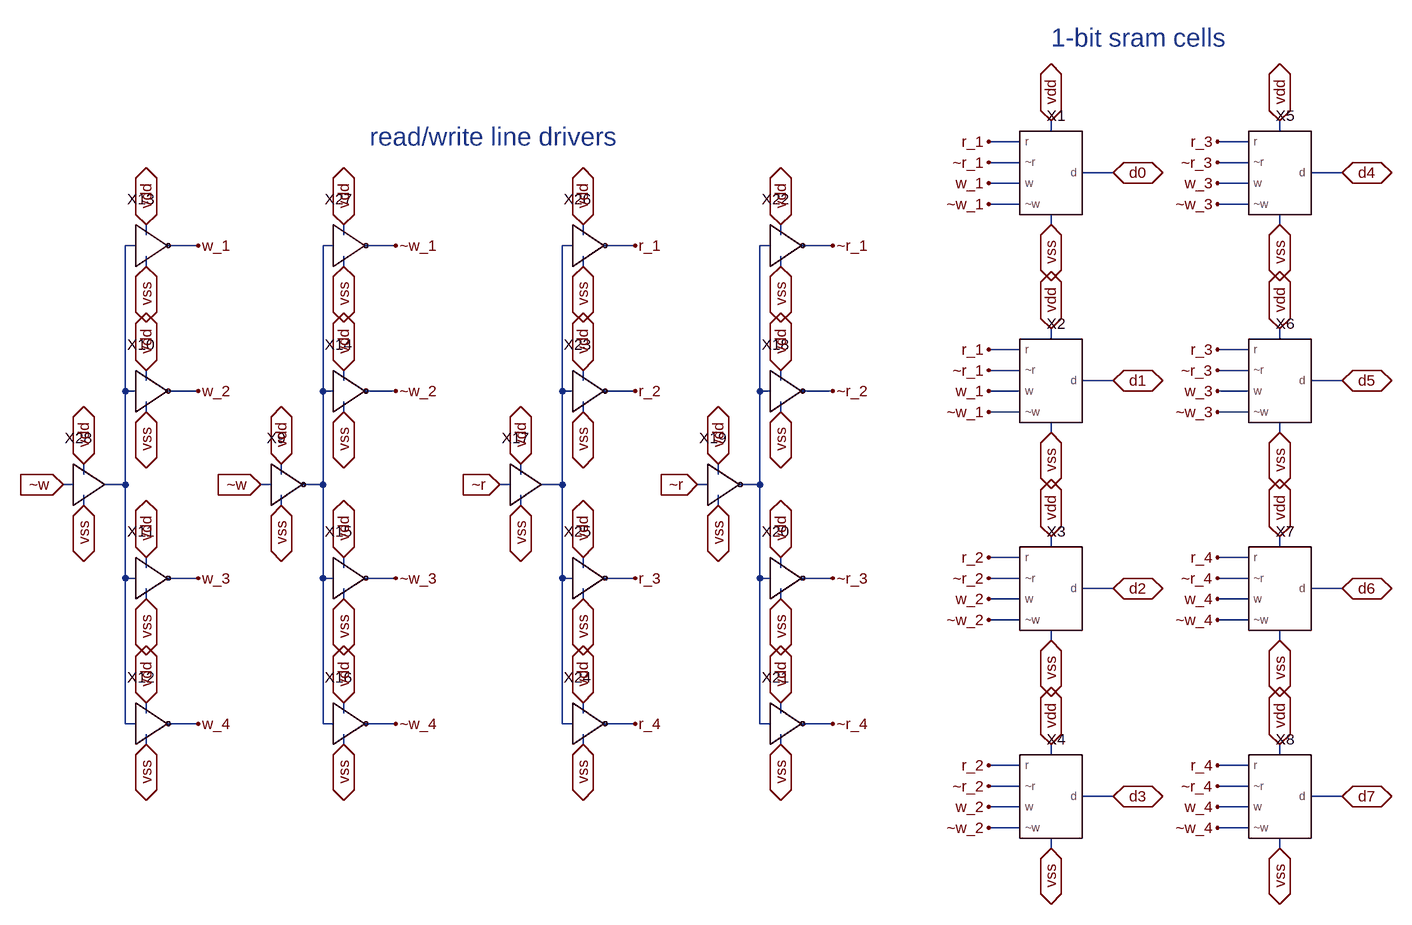
[diagram p0: schematic 8_bit_sram_cell.asc]
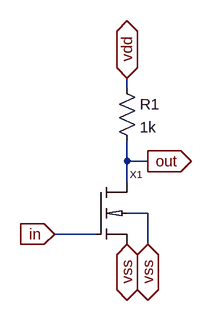
[diagram p1: sub-circuit not.asc]
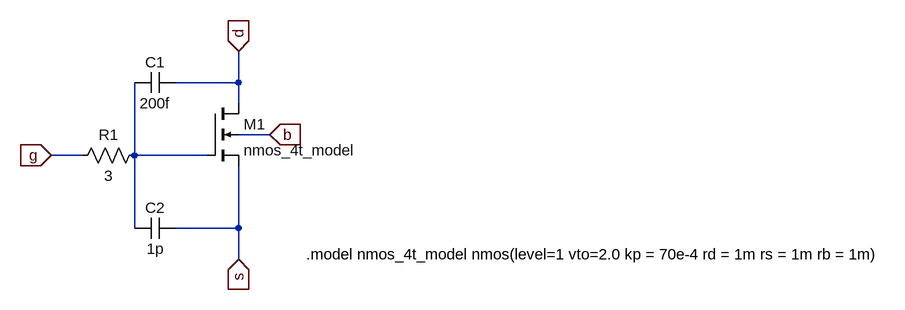
[diagram p2: sub-circuit nmos_4t.asc]
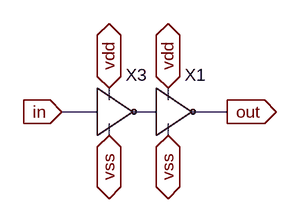
[diagram p3: sub-circuit buffer.asc]
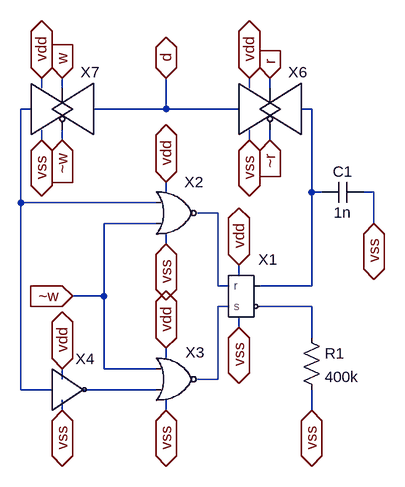
[diagram p4: sub-circuit 1_bit_sram_cell.asc]
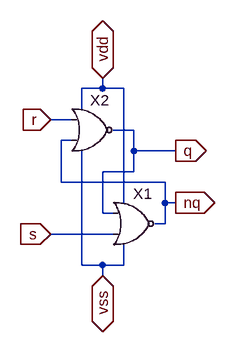
[diagram p5: sub-circuit sr_latch.asc]
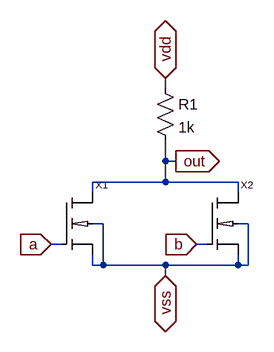
[diagram p6: sub-circuit nor.asc]
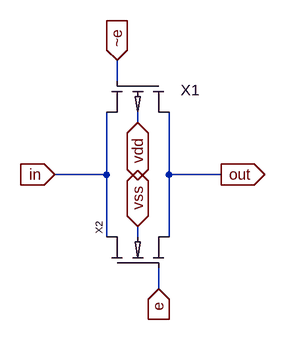
[diagram p7: sub-circuit transmission_gate.asc]
8_bit_sram_cell.asc, the LTspice schematic file:
Version 4
SHEET 1 880 1872
WIRE 208 -1088 208 -1104
WIRE 560 -1088 560 -1104
WIRE 160 -1072 112 -1072
WIRE 512 -1072 464 -1072
WIRE 160 -1040 112 -1040
WIRE 512 -1040 464 -1040
WIRE 304 -1024 256 -1024
WIRE 656 -1024 608 -1024
WIRE 160 -1008 112 -1008
WIRE 512 -1008 464 -1008
WIRE 160 -976 112 -976
WIRE 512 -976 464 -976
WIRE 208 -944 208 -960
WIRE 560 -944 560 -960
WIRE -1184 -928 -1184 -944
WIRE -880 -928 -880 -944
WIRE -512 -928 -512 -944
WIRE -208 -928 -208 -944
WIRE -1200 -912 -1216 -912
WIRE -1104 -912 -1152 -912
WIRE -896 -912 -912 -912
WIRE -800 -912 -848 -912
WIRE -528 -912 -544 -912
WIRE -432 -912 -480 -912
WIRE -224 -912 -240 -912
WIRE -128 -912 -176 -912
WIRE -1184 -880 -1184 -896
WIRE -880 -880 -880 -896
WIRE -512 -880 -512 -896
WIRE -208 -880 -208 -896
WIRE 208 -768 208 -784
WIRE 560 -768 560 -784
WIRE 160 -752 112 -752
WIRE 512 -752 464 -752
WIRE 160 -720 112 -720
WIRE 512 -720 464 -720
WIRE -1184 -704 -1184 -720
WIRE -880 -704 -880 -720
WIRE -512 -704 -512 -720
WIRE -208 -704 -208 -720
WIRE 304 -704 256 -704
WIRE 656 -704 608 -704
WIRE -1216 -688 -1216 -912
WIRE -1200 -688 -1216 -688
WIRE -1104 -688 -1152 -688
WIRE -912 -688 -912 -912
WIRE -896 -688 -912 -688
WIRE -800 -688 -848 -688
WIRE -544 -688 -544 -912
WIRE -528 -688 -544 -688
WIRE -432 -688 -480 -688
WIRE -240 -688 -240 -912
WIRE -224 -688 -240 -688
WIRE -128 -688 -176 -688
WIRE 160 -688 112 -688
WIRE 512 -688 464 -688
WIRE -1184 -656 -1184 -672
WIRE -880 -656 -880 -672
WIRE -512 -656 -512 -672
WIRE -208 -656 -208 -672
WIRE 160 -656 112 -656
WIRE 512 -656 464 -656
WIRE 208 -624 208 -640
WIRE 560 -624 560 -640
WIRE -1280 -560 -1280 -576
WIRE -976 -560 -976 -576
WIRE -608 -560 -608 -576
WIRE -304 -560 -304 -576
WIRE -1296 -544 -1312 -544
WIRE -1216 -544 -1216 -688
WIRE -1216 -544 -1248 -544
WIRE -992 -544 -1008 -544
WIRE -912 -544 -912 -688
WIRE -912 -544 -944 -544
WIRE -624 -544 -640 -544
WIRE -544 -544 -544 -688
WIRE -544 -544 -576 -544
WIRE -320 -544 -336 -544
WIRE -240 -544 -240 -688
WIRE -240 -544 -272 -544
WIRE -1280 -512 -1280 -528
WIRE -976 -512 -976 -528
WIRE -608 -512 -608 -528
WIRE -304 -512 -304 -528
WIRE 208 -448 208 -464
WIRE 560 -448 560 -464
WIRE 160 -432 112 -432
WIRE 512 -432 464 -432
WIRE -1184 -416 -1184 -432
WIRE -880 -416 -880 -432
WIRE -512 -416 -512 -432
WIRE -208 -416 -208 -432
WIRE -1216 -400 -1216 -544
WIRE -1200 -400 -1216 -400
WIRE -1104 -400 -1152 -400
WIRE -912 -400 -912 -544
WIRE -896 -400 -912 -400
WIRE -800 -400 -848 -400
WIRE -544 -400 -544 -544
WIRE -528 -400 -544 -400
WIRE -432 -400 -480 -400
WIRE -240 -400 -240 -544
WIRE -224 -400 -240 -400
WIRE -128 -400 -176 -400
WIRE 160 -400 112 -400
WIRE 512 -400 464 -400
WIRE 304 -384 256 -384
WIRE 656 -384 608 -384
WIRE -1184 -368 -1184 -384
WIRE -880 -368 -880 -384
WIRE -512 -368 -512 -384
WIRE -208 -368 -208 -384
WIRE 160 -368 112 -368
WIRE 512 -368 464 -368
WIRE 160 -336 112 -336
WIRE 512 -336 464 -336
WIRE 208 -304 208 -320
WIRE 560 -304 560 -320
WIRE -1184 -192 -1184 -208
WIRE -880 -192 -880 -208
WIRE -512 -192 -512 -208
WIRE -208 -192 -208 -208
WIRE -1216 -176 -1216 -400
WIRE -1200 -176 -1216 -176
WIRE -1104 -176 -1152 -176
WIRE -912 -176 -912 -400
WIRE -896 -176 -912 -176
WIRE -800 -176 -848 -176
WIRE -544 -176 -544 -400
WIRE -528 -176 -544 -176
WIRE -432 -176 -480 -176
WIRE -240 -176 -240 -400
WIRE -224 -176 -240 -176
WIRE -128 -176 -176 -176
WIRE -1184 -144 -1184 -160
WIRE -880 -144 -880 -160
WIRE -512 -144 -512 -160
WIRE -208 -144 -208 -160
WIRE 208 -128 208 -144
WIRE 560 -128 560 -144
WIRE 160 -112 112 -112
WIRE 512 -112 464 -112
WIRE 160 -80 112 -80
WIRE 512 -80 464 -80
WIRE 304 -64 256 -64
WIRE 656 -64 608 -64
WIRE 160 -48 112 -48
WIRE 512 -48 464 -48
WIRE 160 -16 112 -16
WIRE 512 -16 464 -16
WIRE 208 16 208 0
WIRE 560 16 560 0
FLAG 208 -1104 vdd
IOPIN 208 -1104 BiDir
FLAG 208 -944 vss
IOPIN 208 -944 BiDir
FLAG 208 -784 vdd
IOPIN 208 -784 BiDir
FLAG 208 -624 vss
IOPIN 208 -624 BiDir
FLAG 208 -464 vdd
IOPIN 208 -464 BiDir
FLAG 208 -304 vss
IOPIN 208 -304 BiDir
FLAG 208 -144 vdd
IOPIN 208 -144 BiDir
FLAG 208 16 vss
IOPIN 208 16 BiDir
FLAG 560 -1104 vdd
IOPIN 560 -1104 BiDir
FLAG 560 -944 vss
IOPIN 560 -944 BiDir
FLAG 560 -784 vdd
IOPIN 560 -784 BiDir
FLAG 560 -624 vss
IOPIN 560 -624 BiDir
FLAG 560 -464 vdd
IOPIN 560 -464 BiDir
FLAG 560 -304 vss
IOPIN 560 -304 BiDir
FLAG 560 -144 vdd
IOPIN 560 -144 BiDir
FLAG 560 16 vss
IOPIN 560 16 BiDir
FLAG -608 -576 vdd
IOPIN -608 -576 BiDir
FLAG -608 -512 vss
IOPIN -608 -512 BiDir
FLAG -640 -544 ~r
IOPIN -640 -544 In
FLAG -512 -656 vss
IOPIN -512 -656 BiDir
FLAG -512 -720 vdd
IOPIN -512 -720 BiDir
FLAG -432 -912 r_1
FLAG -512 -368 vss
IOPIN -512 -368 BiDir
FLAG -512 -432 vdd
IOPIN -512 -432 BiDir
FLAG -432 -688 r_2
FLAG -512 -144 vss
IOPIN -512 -144 BiDir
FLAG -512 -208 vdd
IOPIN -512 -208 BiDir
FLAG -432 -400 r_3
FLAG -512 -880 vss
IOPIN -512 -880 BiDir
FLAG -512 -944 vdd
IOPIN -512 -944 BiDir
FLAG -432 -176 r_4
FLAG -304 -576 vdd
IOPIN -304 -576 BiDir
FLAG -304 -512 vss
IOPIN -304 -512 BiDir
FLAG -336 -544 ~r
IOPIN -336 -544 In
FLAG -208 -656 vss
IOPIN -208 -656 BiDir
FLAG -208 -720 vdd
IOPIN -208 -720 BiDir
FLAG -128 -912 ~r_1
FLAG -208 -368 vss
IOPIN -208 -368 BiDir
FLAG -208 -432 vdd
IOPIN -208 -432 BiDir
FLAG -128 -688 ~r_2
FLAG -208 -144 vss
IOPIN -208 -144 BiDir
FLAG -208 -208 vdd
IOPIN -208 -208 BiDir
FLAG -128 -400 ~r_3
FLAG -208 -880 vss
IOPIN -208 -880 BiDir
FLAG -208 -944 vdd
IOPIN -208 -944 BiDir
FLAG -128 -176 ~r_4
FLAG -1280 -576 vdd
IOPIN -1280 -576 BiDir
FLAG -1280 -512 vss
IOPIN -1280 -512 BiDir
FLAG -1312 -544 ~w
IOPIN -1312 -544 In
FLAG -1184 -656 vss
IOPIN -1184 -656 BiDir
FLAG -1184 -720 vdd
IOPIN -1184 -720 BiDir
FLAG -1104 -912 w_1
FLAG -1184 -368 vss
IOPIN -1184 -368 BiDir
FLAG -1184 -432 vdd
IOPIN -1184 -432 BiDir
FLAG -1104 -688 w_2
FLAG -1184 -144 vss
IOPIN -1184 -144 BiDir
FLAG -1184 -208 vdd
IOPIN -1184 -208 BiDir
FLAG -1104 -400 w_3
FLAG -1184 -880 vss
IOPIN -1184 -880 BiDir
FLAG -1184 -944 vdd
IOPIN -1184 -944 BiDir
FLAG -1104 -176 w_4
FLAG -976 -576 vdd
IOPIN -976 -576 BiDir
FLAG -976 -512 vss
IOPIN -976 -512 BiDir
FLAG -1008 -544 ~w
IOPIN -1008 -544 In
FLAG -880 -656 vss
IOPIN -880 -656 BiDir
FLAG -880 -720 vdd
IOPIN -880 -720 BiDir
FLAG -800 -912 ~w_1
FLAG -880 -368 vss
IOPIN -880 -368 BiDir
FLAG -880 -432 vdd
IOPIN -880 -432 BiDir
FLAG -800 -688 ~w_2
FLAG -880 -144 vss
IOPIN -880 -144 BiDir
FLAG -880 -208 vdd
IOPIN -880 -208 BiDir
FLAG -800 -400 ~w_3
FLAG -880 -880 vss
IOPIN -880 -880 BiDir
FLAG -880 -944 vdd
IOPIN -880 -944 BiDir
FLAG -800 -176 ~w_4
FLAG 112 -1072 r_1
FLAG 112 -1040 ~r_1
FLAG 112 -1008 w_1
FLAG 112 -976 ~w_1
FLAG 112 -752 r_1
FLAG 112 -720 ~r_1
FLAG 112 -688 w_1
FLAG 112 -656 ~w_1
FLAG 112 -432 r_2
FLAG 112 -400 ~r_2
FLAG 112 -368 w_2
FLAG 112 -336 ~w_2
FLAG 464 -1072 r_3
FLAG 464 -1040 ~r_3
FLAG 464 -1008 w_3
FLAG 464 -976 ~w_3
FLAG 112 -112 r_2
FLAG 112 -80 ~r_2
FLAG 112 -48 w_2
FLAG 112 -16 ~w_2
FLAG 464 -752 r_3
FLAG 464 -720 ~r_3
FLAG 464 -688 w_3
FLAG 464 -656 ~w_3
FLAG 464 -432 r_4
FLAG 464 -400 ~r_4
FLAG 464 -368 w_4
FLAG 464 -336 ~w_4
FLAG 464 -112 r_4
FLAG 464 -80 ~r_4
FLAG 464 -48 w_4
FLAG 464 -16 ~w_4
FLAG 304 -1024 d0
IOPIN 304 -1024 BiDir
FLAG 304 -704 d1
IOPIN 304 -704 BiDir
FLAG 304 -384 d2
IOPIN 304 -384 BiDir
FLAG 304 -64 d3
IOPIN 304 -64 BiDir
FLAG 656 -1024 d4
IOPIN 656 -1024 BiDir
FLAG 656 -704 d5
IOPIN 656 -704 BiDir
FLAG 656 -384 d6
IOPIN 656 -384 BiDir
FLAG 656 -64 d7
IOPIN 656 -64 BiDir
SYMBOL not -320 -544 R0
SYMATTR InstName X19
SYMBOL not -528 -688 R0
SYMATTR InstName X23
SYMBOL not -528 -400 R0
SYMATTR InstName X25
SYMBOL not -528 -176 R0
SYMATTR InstName X24
SYMBOL not -528 -912 R0
SYMATTR InstName X26
SYMBOL not -224 -688 R0
SYMATTR InstName X18
SYMBOL not -224 -400 R0
SYMATTR InstName X20
SYMBOL not -224 -176 R0
SYMATTR InstName X21
SYMBOL not -224 -912 R0
SYMATTR InstName X22
SYMBOL buffer -624 -544 R0
SYMATTR InstName X17
SYMBOL not -992 -544 R0
SYMATTR InstName X9
SYMBOL not -1200 -688 R0
SYMATTR InstName X10
SYMBOL not -1200 -400 R0
SYMATTR InstName X11
SYMBOL not -1200 -176 R0
SYMATTR InstName X12
SYMBOL not -1200 -912 R0
SYMATTR InstName X13
SYMBOL not -896 -688 R0
SYMATTR InstName X14
SYMBOL not -896 -400 R0
SYMATTR InstName X15
SYMBOL not -896 -176 R0
SYMATTR InstName X16
SYMBOL not -896 -912 R0
SYMATTR InstName X27
SYMBOL buffer -1296 -544 R0
SYMATTR InstName X28
SYMBOL 1_bit_sram_cell 208 -1024 R0
SYMATTR InstName X1
SYMBOL 1_bit_sram_cell 208 -704 R0
SYMATTR InstName X2
SYMBOL 1_bit_sram_cell 208 -384 R0
SYMATTR InstName X3
SYMBOL 1_bit_sram_cell 208 -64 R0
SYMATTR InstName X4
SYMBOL 1_bit_sram_cell 560 -1024 R0
SYMATTR InstName X5
SYMBOL 1_bit_sram_cell 560 -704 R0
SYMATTR InstName X6
SYMBOL 1_bit_sram_cell 560 -384 R0
SYMATTR InstName X7
SYMBOL 1_bit_sram_cell 560 -64 R0
SYMATTR InstName X8
TEXT -840 -1080 Left 4 ;read/write line drivers
TEXT 208 -1232 Left 4 ;1-bit sram cells

not.asc, the sub-circuit schematic file:
Version 4
SHEET 1 880 680
WIRE 176 -96 176 -112
WIRE 176 16 176 -16
WIRE 208 16 176 16
WIRE 176 48 176 16
WIRE 208 96 176 96
WIRE 128 128 64 128
WIRE 208 144 208 96
FLAG 64 128 in
IOPIN 64 128 In
FLAG 176 144 vss
IOPIN 176 144 BiDir
FLAG 176 -112 vdd
IOPIN 176 -112 BiDir
FLAG 208 16 out
IOPIN 208 16 Out
FLAG 208 144 vss
IOPIN 208 144 BiDir
SYMBOL res 160 -112 R0
SYMATTR InstName R1
SYMATTR Value 1k
SYMBOL nmos_4t 128 48 R0
SYMATTR InstName X1

nmos_4t.asc, the sub-circuit schematic file:
Version 4
SHEET 1 880 680
WIRE -288 -224 -288 -272
WIRE -288 -224 -384 -224
WIRE -288 -192 -288 -224
WIRE -240 -144 -288 -144
WIRE -528 -112 -576 -112
WIRE -448 -112 -448 -224
WIRE -336 -112 -448 -112
WIRE -448 0 -448 -112
WIRE -288 0 -288 -96
WIRE -288 0 -384 0
WIRE -288 48 -288 0
FLAG -576 -112 g
IOPIN -576 -112 In
FLAG -288 -272 d
IOPIN -288 -272 In
FLAG -288 48 s
IOPIN -288 48 In
FLAG -240 -144 b
IOPIN -240 -144 In
SYMBOL nmos4 -336 -192 R0
SYMATTR InstName M1
SYMATTR Value nmos_4t_model
SYMBOL cap -384 -240 R90
WINDOW 0 0 32 VBottom 2
WINDOW 3 32 32 VTop 2
SYMATTR InstName C1
SYMATTR Value 200f
SYMBOL cap -384 -16 R90
WINDOW 0 0 32 VBottom 2
WINDOW 3 32 32 VTop 2
SYMATTR InstName C2
SYMATTR Value 1p
SYMBOL res -432 -128 R90
WINDOW 0 0 56 VBottom 2
WINDOW 3 32 56 VTop 2
SYMATTR InstName R1
SYMATTR Value 3
TEXT -184 40 Left 2 !.model nmos_4t_model nmos(level=1 vto=2.0 kp = 70e-4 rd = 1m rs = 1m rb = 1m)

buffer.asc, the sub-circuit schematic file:
Version 4
SHEET 1 880 680
WIRE -48 48 -48 32
WIRE 32 48 32 32
WIRE -64 64 -112 64
WIRE 16 64 -16 64
WIRE 112 64 64 64
WIRE -48 96 -48 80
WIRE 32 96 32 80
FLAG -112 64 in
IOPIN -112 64 In
FLAG -48 32 vdd
IOPIN -48 32 BiDir
FLAG 112 64 out
IOPIN 112 64 Out
FLAG -48 96 vss
IOPIN -48 96 BiDir
FLAG 32 96 vss
IOPIN 32 96 BiDir
FLAG 32 32 vdd
IOPIN 32 32 BiDir
SYMBOL not -64 64 R0
WINDOW 0 53 -34 Bottom 2
SYMATTR InstName X3
SYMBOL not 16 64 R0
WINDOW 0 53 -34 Bottom 2
SYMATTR InstName X1

1_bit_sram_cell.asc, the sub-circuit schematic file:
Version 4
SHEET 1 880 680
WIRE -128 -96 -128 -112
WIRE -96 -96 -96 -112
WIRE 192 -96 192 -112
WIRE 224 -96 224 -112
WIRE -144 -64 -160 -64
WIRE 64 -64 64 -112
WIRE 64 -64 -48 -64
WIRE 176 -64 64 -64
WIRE 288 -64 272 -64
WIRE -128 -16 -128 -32
WIRE -96 -16 -96 -32
WIRE 192 -16 192 -32
WIRE 224 -16 224 -32
WIRE 64 64 64 48
WIRE 288 64 288 -64
WIRE 304 64 288 64
WIRE 384 64 368 64
WIRE -160 80 -160 -64
WIRE 48 80 -160 80
WIRE 144 96 112 96
WIRE 48 112 -32 112
WIRE 384 112 384 64
WIRE 64 144 64 128
WIRE 176 192 176 176
WIRE 144 208 144 96
WIRE 160 208 144 208
WIRE 288 208 288 64
WIRE 288 208 208 208
WIRE -32 224 -32 112
WIRE -32 224 -80 224
WIRE 160 240 144 240
WIRE 288 240 208 240
WIRE 176 272 176 256
WIRE 288 288 288 240
WIRE 64 320 64 304
WIRE -32 336 -32 224
WIRE 48 336 -32 336
WIRE -96 352 -96 336
WIRE 144 352 144 240
WIRE 144 352 112 352
WIRE -160 368 -160 80
WIRE -112 368 -160 368
WIRE 48 368 -64 368
WIRE -96 400 -96 384
WIRE 64 400 64 384
WIRE 288 400 288 368
FLAG 64 48 vdd
IOPIN 64 48 BiDir
FLAG 64 144 vss
IOPIN 64 144 BiDir
FLAG 64 304 vdd
IOPIN 64 304 BiDir
FLAG 64 400 vss
IOPIN 64 400 BiDir
FLAG -96 -112 w
IOPIN -96 -112 In
FLAG 224 -112 r
IOPIN 224 -112 In
FLAG -80 224 ~w
IOPIN -80 224 In
FLAG 64 -112 d
IOPIN 64 -112 BiDir
FLAG -96 -16 ~w
IOPIN -96 -16 In
FLAG 224 -16 ~r
IOPIN 224 -16 In
FLAG -128 -112 vdd
IOPIN -128 -112 BiDir
FLAG -128 -16 vss
IOPIN -128 -16 BiDir
FLAG 192 -112 vdd
IOPIN 192 -112 BiDir
FLAG 192 -16 vss
IOPIN 192 -16 BiDir
FLAG 176 272 vss
IOPIN 176 272 BiDir
FLAG 176 176 vdd
IOPIN 176 176 BiDir
FLAG 288 400 vss
IOPIN 288 400 BiDir
FLAG -96 400 vss
IOPIN -96 400 BiDir
FLAG -96 336 vdd
IOPIN -96 336 BiDir
FLAG 384 112 vss
IOPIN 384 112 BiDir
SYMBOL sr_latch 192 224 R0
WINDOW 0 29 -41 Bottom 2
SYMATTR InstName X1
SYMBOL nor 80 32 R0
WINDOW 0 12 16 Left 2
SYMATTR InstName X2
SYMBOL nor 80 288 R0
WINDOW 0 14 23 Left 2
SYMATTR InstName X3
SYMBOL transmission_gate -96 -64 R0
WINDOW 0 43 -41 Bottom 2
SYMATTR InstName X7
SYMBOL transmission_gate 224 -64 R0
WINDOW 0 43 -41 Bottom 2
SYMATTR InstName X6
SYMBOL res 272 272 R0
SYMATTR InstName R1
SYMATTR Value 400k
SYMBOL not -112 368 R0
WINDOW 0 51 -32 Bottom 2
SYMATTR InstName X4
SYMBOL cap 368 48 R90
WINDOW 0 0 32 VBottom 2
WINDOW 3 32 32 VTop 2
SYMATTR InstName C1
SYMATTR Value 1n

sr_latch.asc, the sub-circuit schematic file:
Version 4
SHEET 1 880 680
WIRE 208 0 208 -16
WIRE 208 0 176 0
WIRE 240 0 208 0
WIRE 176 32 176 0
WIRE 160 48 128 48
WIRE 256 64 224 64
WIRE 160 80 144 80
WIRE 256 96 256 64
WIRE 320 96 256 96
WIRE 256 128 256 96
WIRE 256 128 208 128
WIRE 144 144 144 80
WIRE 304 144 144 144
WIRE 240 176 240 0
WIRE 304 176 304 144
WIRE 320 176 304 176
WIRE 208 192 208 128
WIRE 224 192 208 192
WIRE 304 208 304 176
WIRE 304 208 288 208
WIRE 224 224 128 224
WIRE 176 272 176 96
WIRE 208 272 176 272
WIRE 240 272 240 240
WIRE 240 272 208 272
WIRE 208 288 208 272
FLAG 128 224 s
IOPIN 128 224 In
FLAG 128 48 r
IOPIN 128 48 In
FLAG 320 96 q
IOPIN 320 96 Out
FLAG 320 176 nq
IOPIN 320 176 Out
FLAG 208 288 vss
IOPIN 208 288 BiDir
FLAG 208 -16 vdd
IOPIN 208 -16 BiDir
SYMBOL nor 256 144 R0
WINDOW 0 -1 18 Left 2
SYMATTR InstName X1
SYMBOL nor 192 0 R0
WINDOW 0 -3 18 Left 2
SYMATTR InstName X2

nor.asc, the sub-circuit schematic file:
Version 4
SHEET 1 880 680
WIRE 240 48 240 32
WIRE 240 160 240 128
WIRE 256 160 240 160
WIRE 240 192 240 160
WIRE 240 192 128 192
WIRE 352 192 240 192
WIRE 128 208 128 192
WIRE 352 208 352 192
WIRE 144 256 128 256
WIRE 368 256 352 256
WIRE 80 288 64 288
WIRE 304 288 288 288
WIRE 128 320 128 304
WIRE 144 320 144 256
WIRE 144 320 128 320
WIRE 240 320 144 320
WIRE 352 320 352 304
WIRE 352 320 240 320
WIRE 368 320 368 256
WIRE 368 320 352 320
WIRE 240 336 240 320
FLAG 240 32 vdd
IOPIN 240 32 BiDir
FLAG 240 336 vss
IOPIN 240 336 BiDir
FLAG 256 160 out
IOPIN 256 160 Out
FLAG 288 288 b
IOPIN 288 288 In
FLAG 64 288 a
IOPIN 64 288 In
SYMBOL res 224 32 R0
SYMATTR InstName R1
SYMATTR Value 1k
SYMBOL nmos_4t 80 208 R0
SYMATTR InstName X1
SYMBOL nmos_4t 304 208 R0
SYMATTR InstName X2

transmission_gate.asc, the sub-circuit schematic file:
Version 4
SHEET 1 880 680
WIRE 208 16 208 -16
WIRE 240 80 240 64
WIRE 192 160 192 64
WIRE 192 160 112 160
WIRE 288 160 288 64
WIRE 368 160 288 160
WIRE 192 256 192 160
WIRE 240 256 240 240
WIRE 288 256 288 160
WIRE 272 336 272 304
FLAG 112 160 in
IOPIN 112 160 In
FLAG 272 336 e
IOPIN 272 336 In
FLAG 368 160 out
IOPIN 368 160 Out
FLAG 208 -16 ~e
IOPIN 208 -16 In
FLAG 240 80 vdd
IOPIN 240 80 BiDir
FLAG 240 240 vss
IOPIN 240 240 BiDir
SYMBOL pmos_4t 288 16 R90
WINDOW 0 14 -47 VRight 2
SYMATTR InstName X1
SYMBOL nmos_4t 192 304 R270
SYMATTR InstName X2

The netlist it stands for:
* 8_bit_sram_cell.asc
XX19 ~r N004 vss vdd not
XX23 N003 r_2 vss vdd not
XX25 N003 r_3 vss vdd not
XX24 N003 r_4 vss vdd not
XX26 N003 r_1 vss vdd not
XX18 N004 ~r_2 vss vdd not
XX20 N004 ~r_3 vss vdd not
XX21 N004 ~r_4 vss vdd not
XX22 N004 ~r_1 vss vdd not
XX17 ~r N003 vss vdd buffer
XX9 ~w N002 vss vdd not
XX10 N001 w_2 vss vdd not
XX11 N001 w_3 vss vdd not
XX12 N001 w_4 vss vdd not
XX13 N001 w_1 vss vdd not
XX14 N002 ~w_2 vss vdd not
XX15 N002 ~w_3 vss vdd not
XX16 N002 ~w_4 vss vdd not
XX27 N002 ~w_1 vss vdd not
XX28 ~w N001 vss vdd buffer
XX1 r_1 w_1 ~r_1 ~w_1 d0 vdd vss 1_bit_sram_cell
XX2 r_1 w_1 ~r_1 ~w_1 d1 vdd vss 1_bit_sram_cell
XX3 r_2 w_2 ~r_2 ~w_2 d2 vdd vss 1_bit_sram_cell
XX4 r_2 w_2 ~r_2 ~w_2 d3 vdd vss 1_bit_sram_cell
XX5 r_3 w_3 ~r_3 ~w_3 d4 vdd vss 1_bit_sram_cell
XX6 r_3 w_3 ~r_3 ~w_3 d5 vdd vss 1_bit_sram_cell
XX7 r_4 w_4 ~r_4 ~w_4 d6 vdd vss 1_bit_sram_cell
XX8 r_4 w_4 ~r_4 ~w_4 d7 vdd vss 1_bit_sram_cell

* block symbol definitions
.subckt not in out vss vdd
R1 vdd out 1k
XX1 out in vss vss nmos_4t
.ends not

.subckt nmos_4t D G S B
M1 d N001 s b nmos_4t_model
C1 d N001 200f
C2 s N001 1p
R1 N001 g 3
.model nmos_4t_model nmos(level=1 vto=2.0 kp = 70e-4 rd = 1m rs = 1m rb = 1m)
.ends nmos_4t

.subckt buffer in out vss vdd
XX3 in N001 vss vdd not
XX1 N001 out vss vdd not
.ends buffer

.subckt 1_bit_sram_cell r w ~r ~w d vdd vss
XX1 N003 N004 N005 N002 vdd vss sr_latch
XX2 N001 ~w vdd vss N003 nor
XX3 ~w N006 vdd vss N004 nor
XX7 w N001 ~w d vdd vss transmission_gate
XX6 r d ~r N002 vdd vss transmission_gate
R1 N005 vss 400k
XX4 N001 N006 vss vdd not
C1 vss N002 1n
.ends 1_bit_sram_cell

.subckt sr_latch r s nq q vdd vss
XX1 q s vdd vss nq nor
XX2 r nq vdd vss q nor
.ends sr_latch

.subckt nor a b vdd vss out
R1 vdd out 1k
XX1 out a vss vss nmos_4t
XX2 out b vss vss nmos_4t
.ends nor

.subckt transmission_gate e in ~e out vdd vss
XX1 out ~e in vdd pmos_4t  ; pins D G S B
XX2 in e out vss nmos_4t
.ends transmission_gate

.model NMOS NMOS
.model PMOS PMOS
.lib standard.mos
* read/write line drivers
* 1-bit sram cells
.backanno
.end